# EAGLE design do_an_2 (1) (EAGLE 9.0.1)
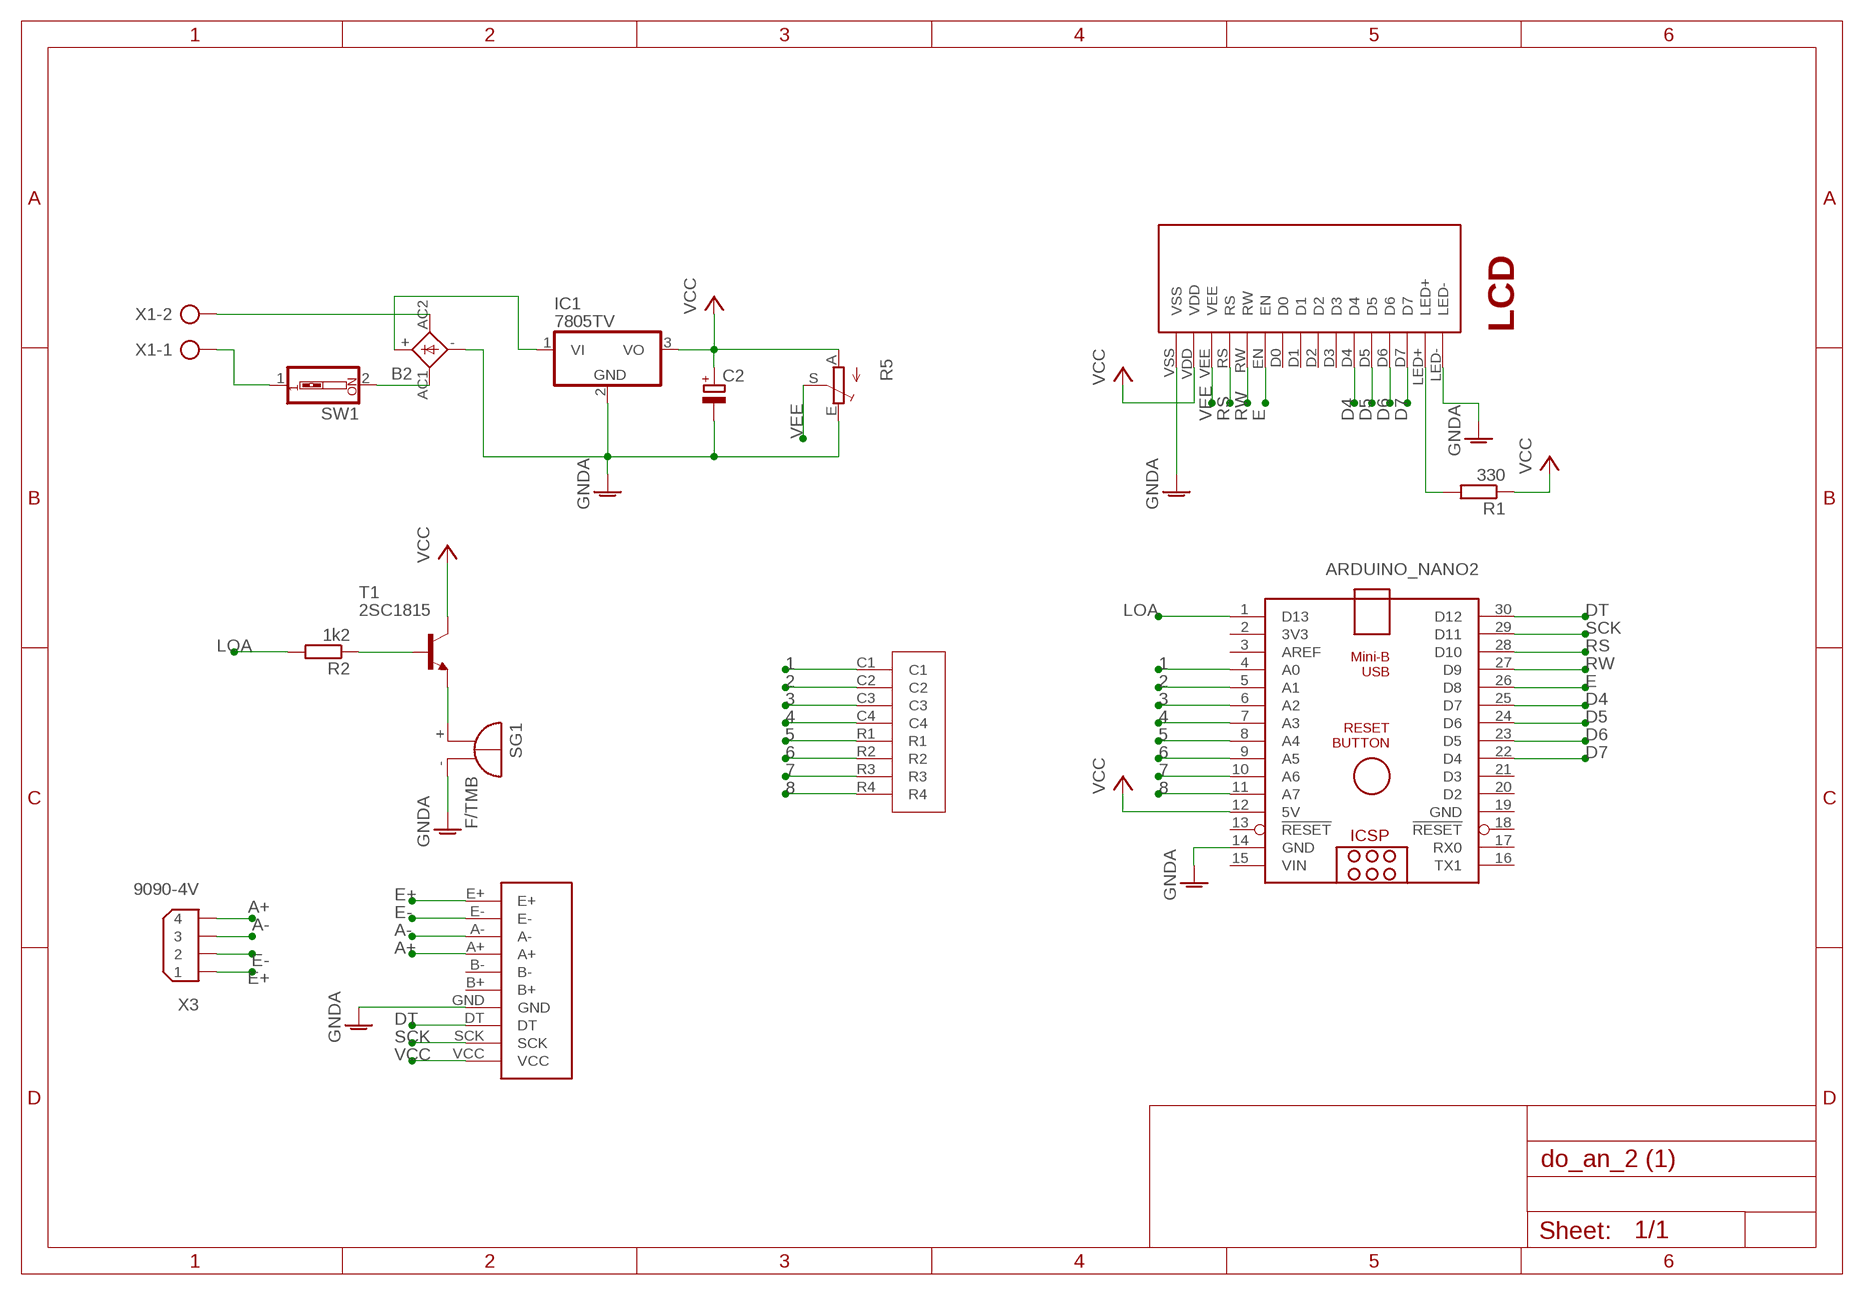
[diagram p0: schematic, sheet 1]

## Parts
ARDUINO_NANO2  ARDUINO_NANO  [ARDUINO_NANO]
B2  2KBP  [2KBP]
C2  CPOL-EUE5-10.5  [E5-10,5]
IC1  7805TV  [TO220V]
R1  330  R-EU_0207/10  [0207/10]
R2  1k2  R-EU_0207/10  [0207/10]
R5  TRIM_EU-S64W  [S64W]
SG1  F/TMB  [F/TMB]
SW1  SW_DIP-1  [EDG-01]
T1  2SC1815  [TO92-ECB]
U$1  LCD20X4  [LCD20X4]
U$2  MA_TRAN_PHIM  [MA_TRAN_PHIM]
U$3  MACHMAUXANH  [MACHMAUXANH]
X1  AK300/2  [AK300/2]
X3  9090-4V  [9090-4V]

## Nets
1: ARDUINO_NANO2.4(A0) U$2.C1
2: ARDUINO_NANO2.5(A1) U$2.C2
3: ARDUINO_NANO2.6(A2) U$2.C3
4: ARDUINO_NANO2.7(A3) U$2.C4
5: ARDUINO_NANO2.8(A4) U$2.R1
6: ARDUINO_NANO2.9(A5) U$2.R2
7: ARDUINO_NANO2.10(A6) U$2.R3
8: ARDUINO_NANO2.11(A7) U$2.R4
A+: U$3.A+ X3.4
A-: U$3.A- X3.3
D4: ARDUINO_NANO2.25(D7) U$1.D4
D5: ARDUINO_NANO2.24(D6) U$1.D5
D6: ARDUINO_NANO2.23(D5) U$1.D6
D7: ARDUINO_NANO2.22(D4) U$1.D7
DT: ARDUINO_NANO2.30(D12) U$3.DT
E: ARDUINO_NANO2.26(D8) U$1.EN
E+: U$3.E+ X3.1
E-: U$3.E- X3.2
GNDA: ARDUINO_NANO2.14(GND) B2.- C2.- IC1.2(GND) R5.E SG1.- U$1.LED- U$1.VSS U$3.GND
LOA: ARDUINO_NANO2.1(D13) R2.2
N$1: R2.1 T1.B
N$2: B2.AC2 X1.2
N$3: B2.AC1 SW1.2
N$4: B2.+ IC1.1(VI)
N$6: R1.2 U$1.LED+
N$9: SG1.+ T1.E
N$14: SW1.1 X1.1
RS: ARDUINO_NANO2.28(D10) U$1.RS
RW: ARDUINO_NANO2.27(D9) U$1.RW
SCK: ARDUINO_NANO2.29(D11) U$3.SCK
VCC: ARDUINO_NANO2.12(5V) C2.+ IC1.3(VO) R1.1 R5.A T1.C U$1.VDD U$3.VCC
VEE: R5.S U$1.VEE
Unconnected: ARDUINO_NANO2.2(3V3) ARDUINO_NANO2.3(AREF) ARDUINO_NANO2.13(!RESET) ARDUINO_NANO2.16(TX1) ARDUINO_NANO2.17(RX0) ARDUINO_NANO2.18(!RESET) ARDUINO_NANO2.20(D2) ARDUINO_NANO2.21(D3) U$1.D0 U$1.D1 U$1.D2 U$1.D3 U$3.B+ U$3.B-

## Power pins joined to a net without a drawn wire
GND: ARDUINO_NANO2.19(GND)
VIN: ARDUINO_NANO2.15(VIN)

## Library data of the parts
ARDUINO_NANO2 = ArduinoNanoV30:ARDUINO_NANO: Arduino Nano V3.0 Overview: The Arduino Nano is a small, complete, and breadboard-friendly board based on the ATmega328 (Arduino Nano 3.x) or ATmega168 (Arduino Nano 2.x). It has more or less the same functionality of the Arduino Duemilanove, but in a different package. It lacks only a DC power jack, and works with a Mini-B USB cable instead of a standard one. The Nano was designed and is being produced by Gravitech. Specifications: Microcontroller Atmel ATmega168 or ATmega328 Operating Voltage (logic level) 5 V Input Voltage (recommended) 7-12 V Input Voltage (limits) 6-20 V Digital I/O Pins 14 (of which 6 provide PWM output) Analog Input Pins 8 DC Current per I/O Pin 40 mA Flash Memory 16 KB (ATmega168) or 32 KB (ATmega328) of which 2 KB used by bootloader SRAM 1 KB (ATmega168) or 2 KB (ATmega328) EEPROM 512 bytes (ATmega168) or 1 KB (ATmega328) Clock Speed 16 MHz Dimensions 0.73" x 1.70" Length 45 mm Width 18 mm Weigth 5 g Power: The Arduino Nano can be powered via the Mini-B USB connection, 6-20V unregulated external power supply (pin 30), or 5V regulated external power supply (pin 27). The power source is automatically selected to the highest voltage source. Memory: The ATmega168 has 16 KB of flash memory for storing code (of which 2 KB is used for the bootloader); the ATmega328 has 32 KB, (also with 2 KB used for the bootloader). The ATmega168 has 1 KB of SRAM and 512 bytes of EEPROM (which can be read and written with the EEPROM library); the ATmega328 has 2 KB of SRAM and 1 KB of EEPROM. Input and Output: Each of the 14 digital pins on the Nano can be used as an input or output, using pinMode(), digitalWrite(), and digitalRead() functions. They operate at 5 volts. Each pin can provide or receive a maximum of 40 mA and has an internal pull-up resistor (disconnected by default) of 20-50 kOhms. In addition, some pins have specialized functions. Visit Arduino - ArduinoBoardNano <https://www.arduino.cc/en/Main/ArduinoBoardNano>
B2 = rectifier:2KBP: RECTIFIER grid 3 x 3,81 mm
C2 = rcl:CPOL-EU: POLARIZED CAPACITOR, European symbol; SPICEPREFIX: C
IC1 = linear:78*: Positive VOLTAGE REGULATOR Source: http://cache.national.com/ds/LM/LM78L05.pdf http://www.fairchildsemi.com/ds/LM/LM7805.pdf
R1 R2 = rcl:R-EU_: RESISTOR, European symbol; SPICEPREFIX: R
R5 = pot:TRIM_EU-: POTENTIOMETER
SG1 = buzzer:F/TMB: BUZZER Source: Buerklin; OC_FARNELL: unknown; OC_NEWARK: unknown
SW1 = special:SW_DIP-1: DIP SWITCH
T1 = transistor:2SC1815: NPN EPITAXIAL TRANSISTOR Source: TOSHIBA .. 2SC1815 1.pdf
U$1 = TUAN:LCD20X4
U$2 = TUAN1:MA_TRAN_PHIM
U$3 = ArduinoNanoV30:MACHMAUXANH
X1 = con-ptr500:AK300/2: CONNECTOR; OC_FARNELL: unknown; OC_NEWARK: unknown
X3 = con-thomas-betts:9090-4: Disk Drive Power four position Source: Thomas & Betts Electronic Interconnects Eiropean Edition 1998; OC_FARNELL: unknown; OC_NEWARK: unknown

## Board
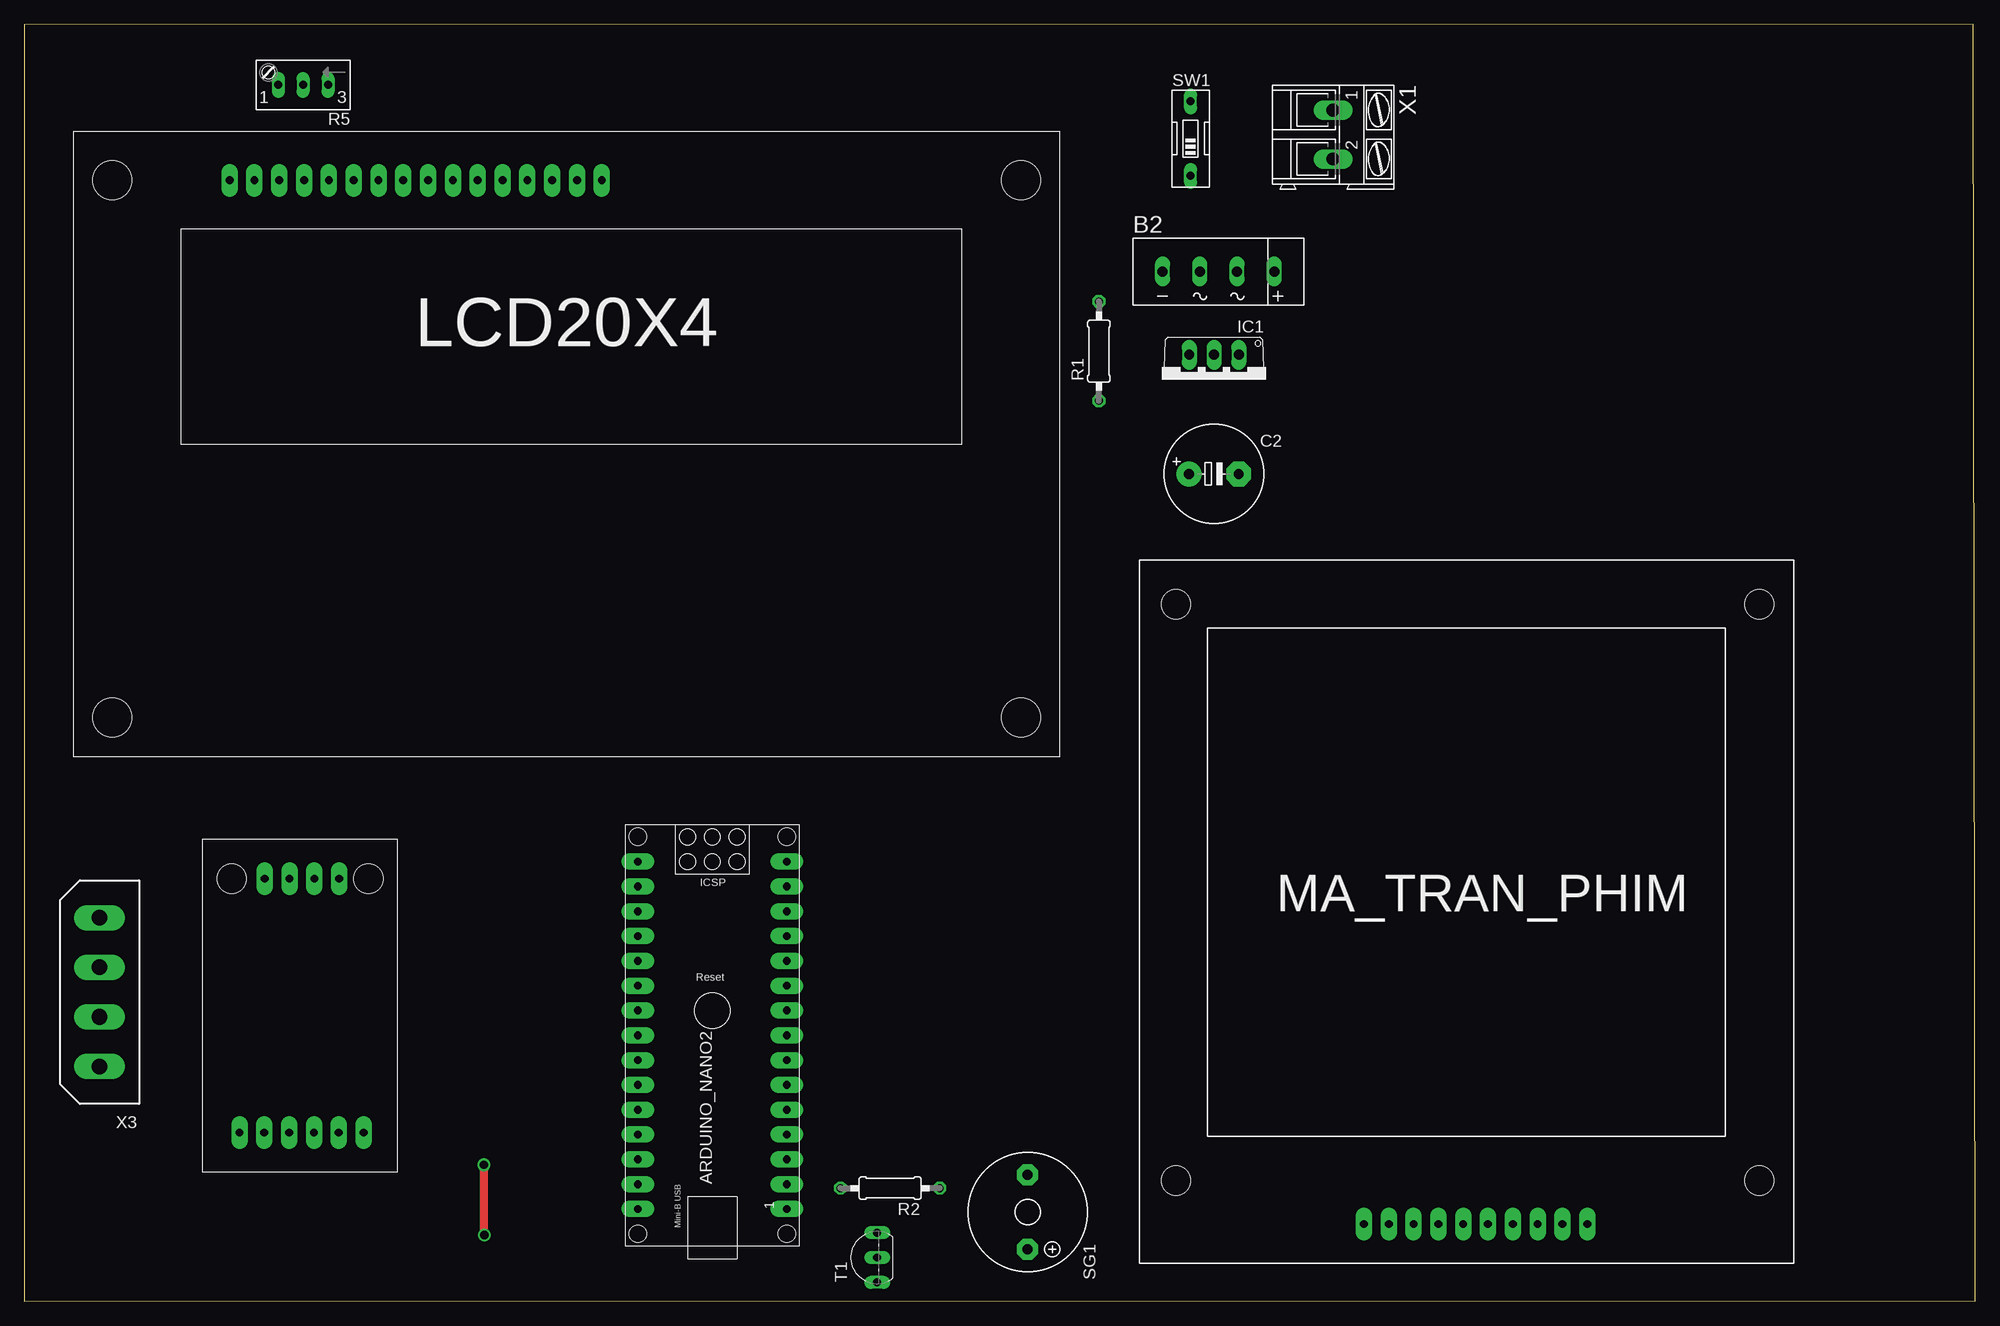
[diagram p1: board, top side]
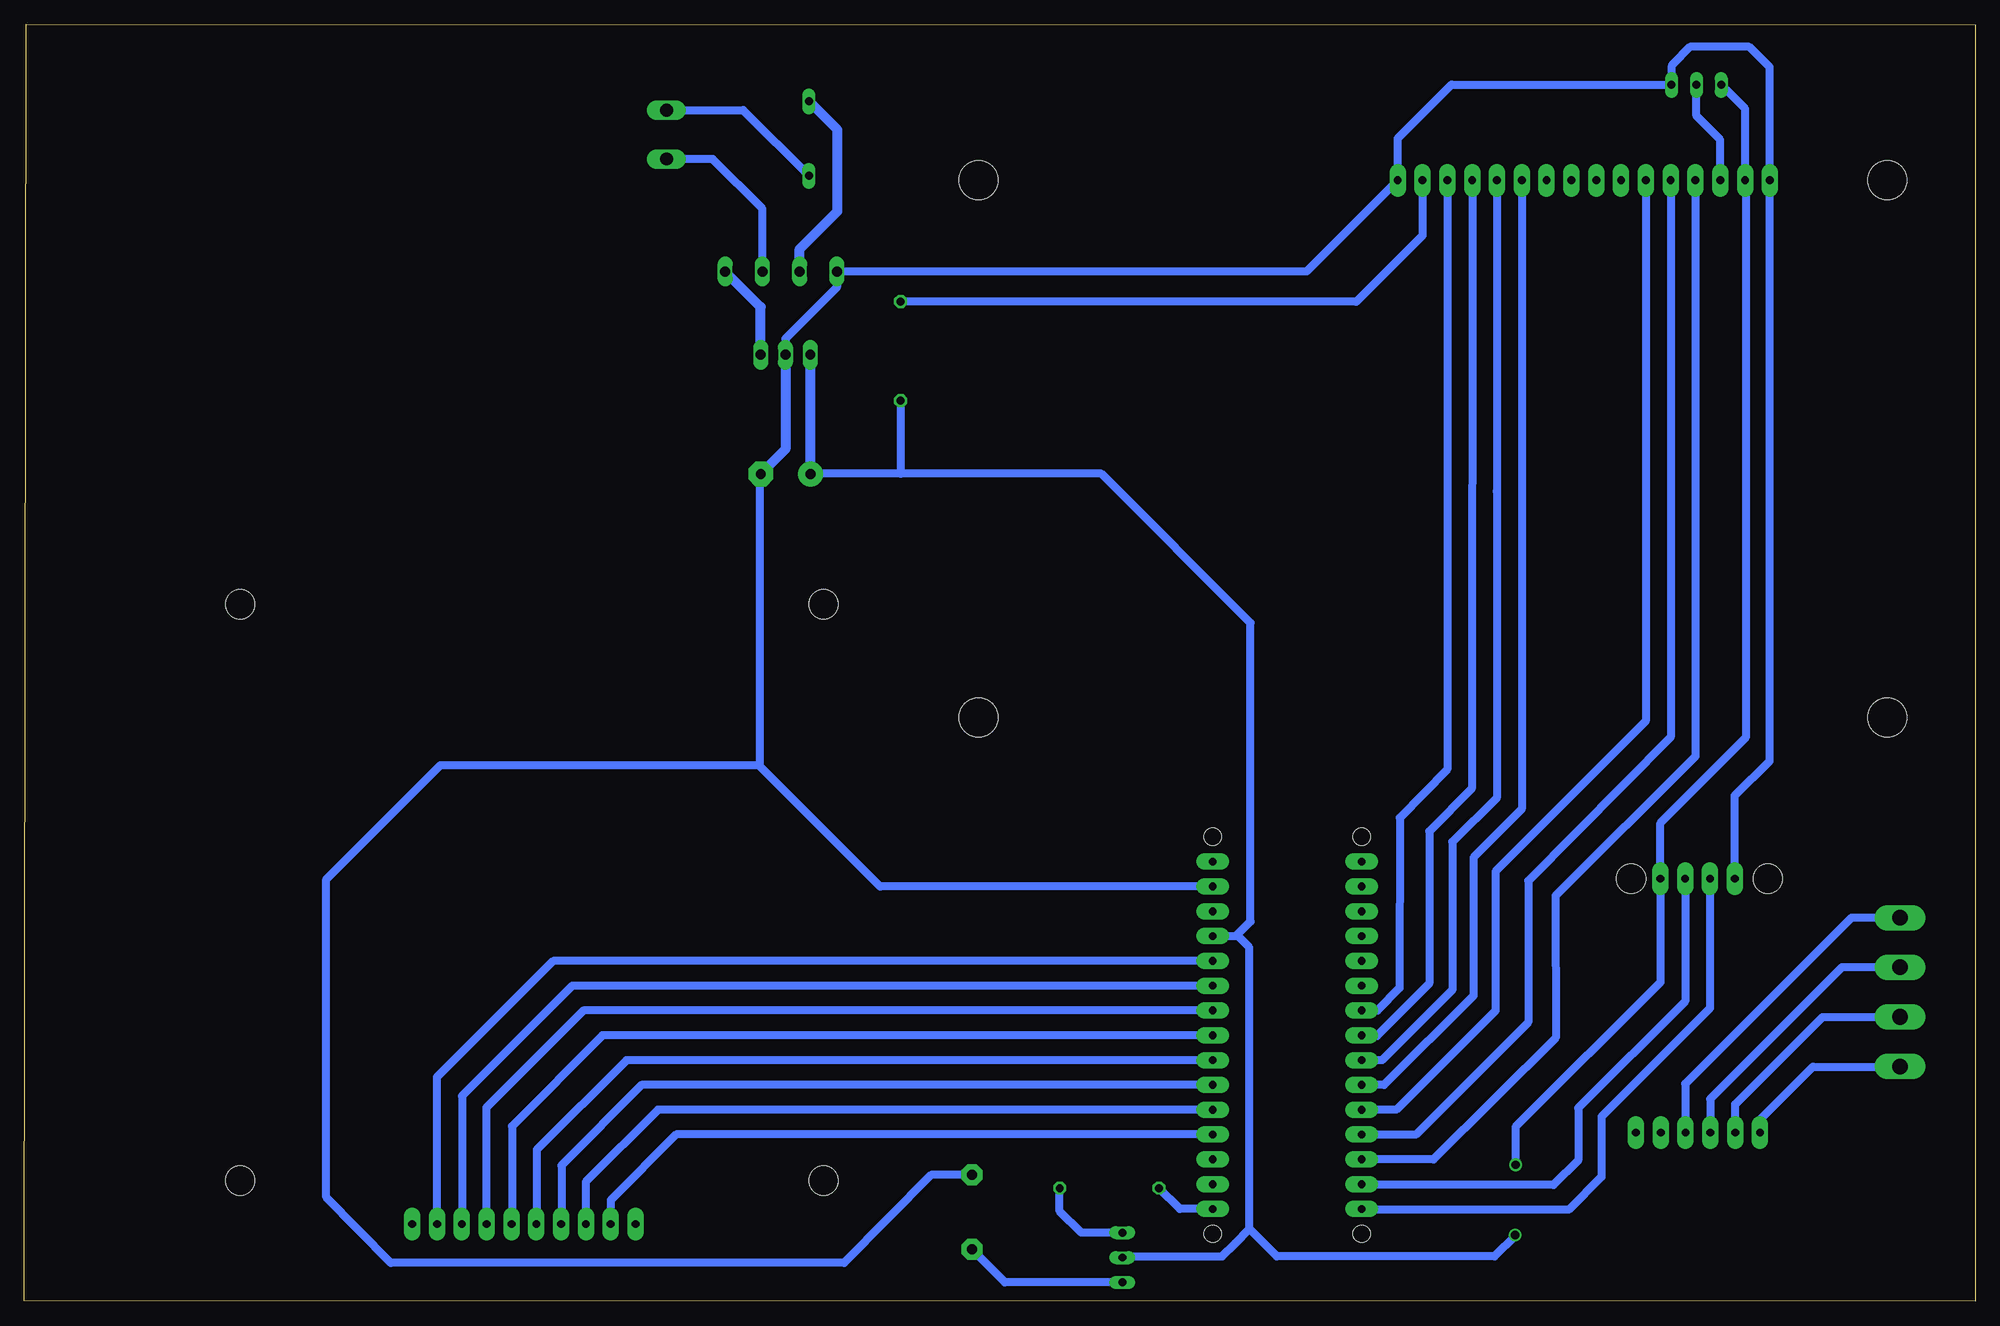
[diagram p2: board, bottom side, seen from below]

Size 199.69 x 130.72 mm. Coordinates in mm from the lower left corner, seen from the top.
Outline: 0,0 199.69,0.05 199.48,130.72 0,130.68 0,0
Copper layers (1*16): Top 0.035mm / dielectric 1.5mm / Bottom 0.035mm
Design rules "default *": minimum track width 30mil, minimum drill 0.8mm, track to track 30mil, track to pad 20mil, pad to pad 20mil, via to via 20mil, smd to smd 6mil, copper to edge 40mil, drill to drill 6mil, minimum pad ring 10mil, minimum via ring 8mil, stop-mask expansion 4mil, vias tented up to drill 0mil, thermal gap 10mil

### Footprints (pad centres in the part's own frame; a part is rotated, then mirrored left to right if it is on the bottom)
ARDUINO_NANO = drill 0.8 pad 1.676 long: 1 -20.32,-7.62; 2 -17.78,-7.62; 3 -15.24,-7.62; 4 -12.7,-7.62; 5 -10.16,-7.62; 6 -7.62,-7.62; 7 -5.08,-7.62; 8 -2.54,-7.62; 9 0,-7.62; 10 2.54,-7.62; 11 5.08,-7.62; 12 7.62,-7.62; 13 10.16,-7.62; 14 12.7,-7.62; 15 15.24,-7.62; 16 15.24,7.62; 17 12.7,7.62; 18 10.16,7.62; 19 7.62,7.62; 20 5.08,7.62; 21 2.54,7.62; 22 0,7.62; 23 -2.54,7.62; 24 -5.08,7.62; 25 -7.62,7.62; 26 -10.16,7.62; 27 -12.7,7.62; 28 -15.24,7.62; 29 -17.78,7.62; 30 -20.32,7.62 | hole 1.778: -22.86,-7.62; -22.86,7.62; 17.78,7.62; 17.78,-7.62
2KBP = drill 1.016 long: + 5.715,0; - -5.715,0; AC1 -1.905,0; AC2 1.905,0
E5-10,5 = drill 1.016 pad 2.54: + -2.54,0 | drill 1.016 pad 2.54 octagon: - 2.54,0
TO220V = drill 1.016 long: 1 -2.54,-2.54; 2 0,-2.54; 3 2.54,-2.54
0207/10 = drill 0.813 octagon: 1 -5.08,0; 2 5.08,0
S64W = drill 0.813 long: A 2.54,1.27; E -2.54,1.27; S 0,1.27
F/TMB = drill 1.016 pad 2.159 octagon: + 3.81,0; - -3.81,0
EDG-01 = drill 0.813 long: 1 0,-3.81; 2 0,3.81
TO92-ECB = drill 0.813 long: B 2.54,0; C 0,0; E -2.54,0
LCD20X4 = drill 0.8 pad 1.676 long: D0 15.24,0; D1 17.78,0; D2 20.32,0; D3 22.86,0; D4 25.4,0; D5 27.94,0; D6 30.48,0; D7 33.02,0; EN 12.7,0; LED+ 35.56,0; LED- 38.1,0; RS 7.62,0; RW 10.16,0; VDD 2.54,0; VEE 5.08,0; VSS 0,0 | hole 4: -12,0; 81,0; -12,-55; 81,-55
MA_TRAN_PHIM = drill 0.8 pad 1.676 long: C1 2.54,0; C2 5.08,0; C3 7.62,0; C4 10.16,0; NC1 0,0; NC2 22.86,0; R1 12.7,0; R2 15.24,0; R3 17.78,0; R4 20.32,0 | hole 3: -19.25,4.45; 40.47,4.45; -19.25,63.45; 40.47,63.45
MACHMAUXANH = drill 0.8 pad 1.676 long: A+ 0,5.08; A- 0,7.62; B+ 0,0; B- 0,2.54; DT 26,7.58; E+ 0,12.7; E- 0,10.16; GND 26,10.12; SCK 26,5.04; VCC 26,2.5 | hole 3: 26,-0.5; 26,13.5
AK300/2 = drill 1.321 long: 1 -2.515,0; 2 2.489,0
9090-4V = drill 1.6 pad 2.6 long: 1 -7.62,0; 2 -2.54,0; 3 2.54,0; 4 7.62,0

### Placement (x,y rotation side)
ARDUINO_NANO2  70.42,29.76 90 top
B2  122.24,105.43 0 top
C2  121.76,84.7 0 top
IC1  121.78,94.36 180 top
R1  109.99,97.27 90 top
R2  88.62,11.58 180 top
R5  28.53,125.81 180 top
SG1  102.7,9.12 270 top
SW1  119.39,119.03 0 top
T1  87.29,4.47 90 top
U$1  21,114.76 0 top
U$2  137.13,7.9 0 top
U$3  34.72,17.26 90 top
X1  133.96,119.44 270 top
X3  7.7,31.65 90 top

### Tracks (layer width: path | path; a pad name or v marks a point on that pad's centre or on a via)
1
  Bottom 0.813: ARDUINO_NANO2.4 132.97,17.06 139.68,10.36 139.68,7.91 U$2.C1
2
  Bottom 0.813: ARDUINO_NANO2.5 134.84,19.6 142.22,12.22 142.22,7.91 U$2.C2
3
  Bottom 0.813: ARDUINO_NANO2.6 136.52,22.14 144.72,13.91 144.72,7.65 144.75,7.62 | 144.97,7.4 144.75,7.62 | 144.75,7.62 U$2.C3
4
  Bottom 0.813: ARDUINO_NANO2.7 138.07,24.68 147.24,15.51 147.24,7.95 U$2.C4
5
  Bottom 0.813: ARDUINO_NANO2.8 140.53,27.22 149.78,17.92 149.78,7.95 U$2.R1
6
  Bottom 0.813: ARDUINO_NANO2.9 142.47,29.76 152.41,19.82 152.41,7.95 U$2.R2
7
  Bottom 0.813: ARDUINO_NANO2.10 143.6,32.3 154.88,21.02 154.88,7.93 U$2.R3
8
  Bottom 0.813: ARDUINO_NANO2.11 145.56,34.84 157.48,22.92 157.48,7.94 U$2.R4
A+
  Bottom 0.813: X3.4 12.65,39.27 29.67,22.26 29.65,17.27 U$3.A+
A-
  Bottom 0.813: X3.3 13.62,34.19 27.1,20.71 27.1,17.29 U$3.A-
D4
  Bottom 0.813: U$1.D4 46.4,50.39 51.35,45.42 51.35,31.28 51.43,31.2 60.49,22.14 ARDUINO_NANO2.25
D5
  Bottom 0.813: U$1.D5 48.96,82.94 48.98,51.52 53.51,47.03 53.51,31.85 53.52,31.89 60.72,24.68 ARDUINO_NANO2.24
D6
  Bottom 0.813: U$1.D6 51.53,52.48 55.87,48.1 55.87,32.52 61.22,27.16 62.74,27.16 ARDUINO_NANO2.23
D7
  Bottom 0.813: U$1.D7 54.02,54.46 58.89,49.49 58.92,32.07 61.18,29.77 62.35,29.77 ARDUINO_NANO2.22
DT
  Bottom 0.813: ARDUINO_NANO2.30 62.78,9.46 62.69,9.37 41.58,9.37 38.24,12.71 38.24,18.88 27.14,29.99 U$3.DT
E
  Bottom 0.813: U$1.EN 33.7,59.4 49.1,44 49.1,29.75 59.24,19.6 62.77,19.59 ARDUINO_NANO2.26
E+
  Bottom 0.813: U$3.E+ 22.02,18.59 16.6,24.01 7.72,24.01 X3.1
E-
  Bottom 0.813: U$3.E- 24.56,20.16 15.61,29.1 X3.2
GNDA
  Bottom 0.813: 59.16,114.81 U$1.LED- | U$3.GND 24.6,51.77 21.03,55.3 21.03,114.73 U$1.VSS 21.04,126.36 23.13,128.43 29.2,128.43 31.02,126.59 31.07,126.39 R5.E 31.09,124.56 53.6,124.56 59.1,119.05 U$1.LED- | IC1.2 121.78,98.54 116.52,103.8 B2.- 68.44,105.43 U$1.LED- | ARDUINO_NANO2.14 112.07,42.46 124.36,54.74 | 124.36,54.74 124.36,84.64 C2.- | 124.36,54.74 124.49,54.88 157.1,54.88 168.78,43.2 168.78,10.66 162.19,3.92 115.78,3.92 106.87,12.94 SG1.-
  Bottom 1.016: IC1.2 121.78,87.22 124.36,84.64
LOA
  Bottom 0.813: ARDUINO_NANO2.1 81.4,9.44 R2.2
N$1
  Bottom 0.813: T1.B 91.49,7.01 93.71,9.23 R2.1
N$2
  Bottom 0.813: B2.AC2 124.14,111.85 129.24,116.94 X1.2
N$3
  Bottom 1.016: B2.AC1 120.33,107.74 116.47,111.6 116.47,119.93 SW1.2
N$4
  Bottom 1.016: IC1.1 124.32,101.8 B2.+
N$6
  Bottom 0.813: U$1.LED+ 56.56,109.1 63.34,102.32 109.96,102.32 R1.2
N$9
  Bottom 0.813: T1.E 99.31,1.93 SG1.+
N$14
  Bottom 0.813: X1.1 126.11,121.95 SW1.1
RS
  Bottom 0.813: U$1.RS 28.62,55.8 42.95,41.52 42.93,26.97 55.44,14.51 62.78,14.51 ARDUINO_NANO2.28
RW
  Bottom 0.813: U$1.RW 31.15,57.75 45.75,43.03 45.75,28.56 57.26,17.06 ARDUINO_NANO2.27
SCK
  Bottom 0.813: ARDUINO_NANO2.29 62.77,12.01 62.67,11.9 43.15,11.9 40.62,14.42 40.62,19.77 29.68,30.71 U$3.SCK
VCC  (via drill 0.85 pad 1.3)
  Top 0.813: v47.03,13.96 47.03,6.82 v47.08,6.77
  Bottom 0.813: R5.A 23.54,122.09 U$1.VDD 23.42,114.64 23.42,57.79 32.22,48.95 U$3.VCC 32.22,32.67 47.04,17.85 v47.04,13.96 v47.03,13.96 | 74.28,7.39 75.73,5.95 77.08,4.59 87.17,4.59 T1.C | 74.28,7.39 74.28,36.21 75.46,37.38 ARDUINO_NANO2.12 75.68,37.38 74.17,38.89 74.17,69.46 89.44,84.73 109.99,84.73 | 109.99,84.73 119.2,84.73 C2.+ | v47.08,6.77 47.08,6.71 49.2,4.59 71.48,4.59 74.28,7.39 | R1.1 109.98,85.98 109.99,84.73
  Bottom 1.016: C2.+ 119.24,84.72 IC1.3
VEE
  Bottom 0.813: U$1.VEE 26.08,118.9 28.53,121.35 R5.S | R5.S